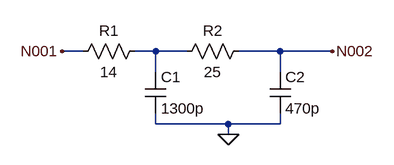
[diagram p0: schematic pasa_bajas_network.asc]
pasa_bajas_network.asc, the LTspice schematic file:
Version 4
SHEET 1 880 680
WIRE 128 64 96 64
WIRE 240 64 208 64
WIRE 288 64 240 64
WIRE 432 64 368 64
WIRE 512 64 432 64
WIRE 240 96 240 64
WIRE 432 96 432 64
WIRE 240 176 240 160
WIRE 352 176 240 176
WIRE 432 176 432 160
WIRE 432 176 352 176
WIRE 352 192 352 176
FLAG 96 64 N001
FLAG 352 192 0
FLAG 512 64 N002
SYMBOL res 224 48 R90
WINDOW 0 0 56 VBottom 2
WINDOW 3 32 56 VTop 2
SYMATTR InstName R1
SYMATTR Value 14
SYMBOL res 384 48 R90
WINDOW 0 0 56 VBottom 2
WINDOW 3 32 56 VTop 2
SYMATTR InstName R2
SYMATTR Value 25
SYMBOL cap 224 96 R0
SYMATTR InstName C1
SYMATTR Value 1300p
SYMBOL cap 416 96 R0
SYMATTR InstName C2
SYMATTR Value 470p

The netlist it stands for:
* pasa_bajas_network.asc
R1 N003 N001 14
R2 N002 N003 25
C1 N003 0 1300p
C2 N002 0 470p
.backanno
.end